# EAGLE design NES Buttons (EAGLE 7.6.0)
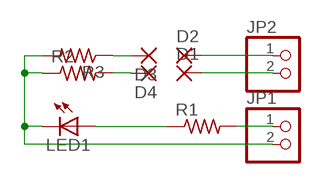
[diagram p0: schematic, sheet 1]

## Parts
D1  2,15/1,0  [2,15/1,0]
D2  2,15/1,0  [2,15/1,0]
D3  2,15/1,0  [2,15/1,0]
D4  2,15/1,0  [2,15/1,0]
JP1  PINHD-1X2  [1X02]
JP2  PINHD-1X2  [1X02]
LED1  LED3MM  [LED3MM]
R1  R-US_R1206  [R1206]
R2  R-US_R1206  [R1206]
R3  R-US_R1206  [R1206]

## Nets
GND: JP1.2 LED1.K(C) R2.1 R3.2
N$1: JP1.1 R1.2
N$2: D3.1(P) R3.1
N$3: D4.1(P) R2.2
N$4: LED1.A R1.1
N$6: D1.1(P) JP2.2
N$7: D2.1(P) JP2.1

## Library data of the parts
D1-D4 = wirepad:2,15/1,0: THROUGH-HOLE PAD
JP1 JP2 = pinhead:PINHD-1X2: PIN HEADER
LED1 = led:LED: LED OSRAM: - CHIPLED LG R971, LG N971, LY N971, LG Q971, LY Q971, LO R971, LY R971 LH N974, LH R974 LS Q976, LO Q976, LY Q976 LO Q996 - Hyper CHIPLED LW Q18S LB Q993, LB Q99A, LB R99A - SideLED LS A670, LO A670, LY A670, LG A670, LP A670 LB A673, LV A673, LT A673, LW A673 LH A674 LY A675 LS A676, LA A676, LO A676, LY A676, LW A676 LS A679, LY A679, LG A679 - Hyper Micro SIDELED® LS Y876, LA Y876, LO Y876, LY Y876 LT Y87S - SmartLED LW L88C, LW L88S LB L89C, LB L89S, LG L890 LS L89K, LO L89K, LY L89K LS L896, LA L896, LO L896, LY L896 - TOPLED LS T670, LO T670, LY T670, LG T670, LP T670 LSG T670, LSP T670, LSY T670, LOP T670, LYG T670 LG T671, LOG T671, LSG T671 LB T673, LV T673, LT T673, LW T673 LH T674 LS T676, LA T676, LO T676, LY T676, LB T676, LH T676, LSB T676, LW T676 LB T67C, LV T67C, LT T67C, LS T67K, LO T67K, LY T67K, LW E67C LS E67B, LA E67B, LO E67B, LY E67B, LB E67C, LV E67C, LT E67C LW T67C LS T679, LY T679, LG T679 LS T770, LO T770, LY T770, LG T770, LP T770 LB T773, LV T773, LT T773, LW T773 LH T774 LS E675, LA E675, LY E675, LS T675 LS T776, LA T776, LO T776, LY T776, LB T776 LHGB T686 LT T68C, LB T68C - Hyper Mini TOPLED® LB M676 - Mini TOPLED Santana® LG M470 LS M47K, LO M47K, LY M47K Source: http://www.osram.convergy.de LUXEON: - LUMILED® LXK2-PW12-R00, LXK2-PW12-S00, LXK2-PW14-U00, LXK2-PW14-V00 LXK2-PM12-R00, LXK2-PM12-S00, LXK2-PM14-U00 LXK2-PE12-Q00, LXK2-PE12-R00, LXK2-PE12-S00, LXK2-PE14-T00, LXK2-PE14-U00 LXK2-PB12-K00, LXK2-PB12-L00, LXK2-PB12-M00, LXK2-PB14-N00, LXK2-PB14-P00, LXK2-PB14-Q00 LXK2-PR12-L00, LXK2-PR12-M00, LXK2-PR14-Q00, LXK2-PR14-R00 LXK2-PD12-Q00, LXK2-PD12-R00, LXK2-PD12-S00 LXK2-PH12-R00, LXK2-PH12-S00 LXK2-PL12-P00, LXK2-PL12-Q00, LXK2-PL12-R00 Source: www.luxeon.com KINGBRIGHT: KA-3528ASYC Source: www.kingbright.com
R1-R3 = resistor:R-US_: RESISTOR, American symbol

## Board
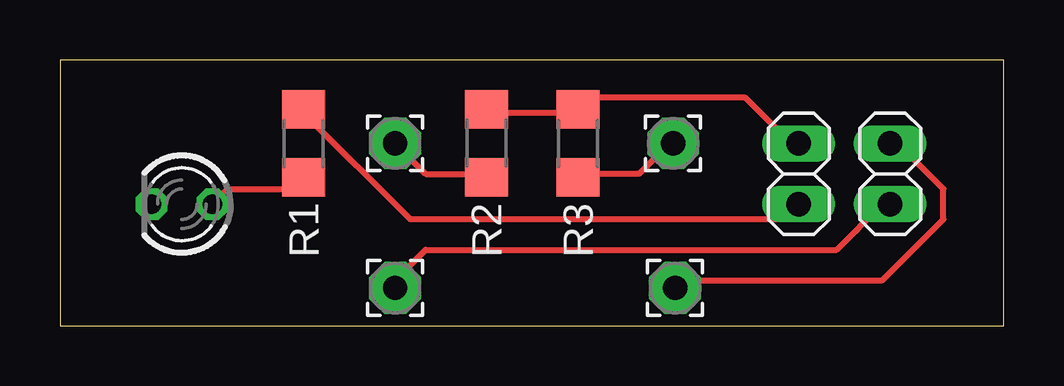
[diagram p1: board, top side]
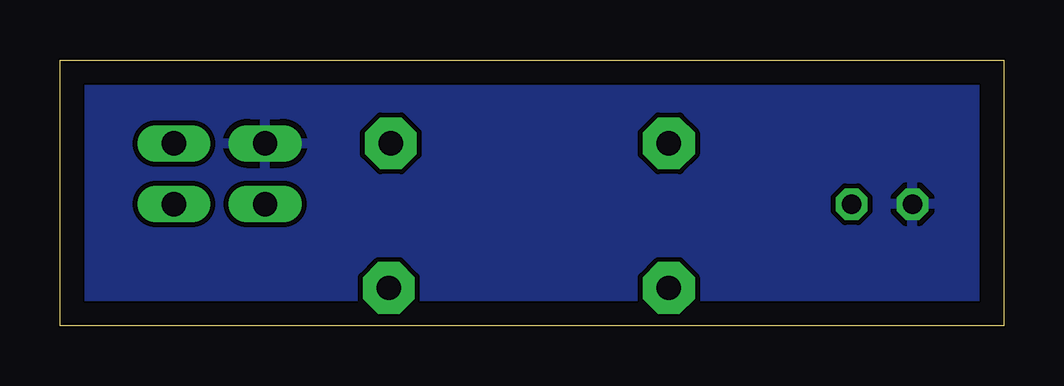
[diagram p2: board, bottom side, seen from below]

Size 39.35 x 11.1 mm. Coordinates in mm from the lower left corner, seen from the top.
Outline: 0,0 39.35,0 39.35,11.1 0,11.1 0,0
Copper layers (1*16): Top 0.035mm / dielectric 1.5mm / Bottom 0.035mm
Design rules "default": minimum track width 10mil, minimum drill 24mil, track to track 8mil, track to pad 8mil, pad to pad 8mil, via to via 8mil, smd to smd 8mil, copper to edge 40mil, drill to drill 8mil, minimum pad ring 10mil, minimum via ring 8mil, stop-mask expansion 4mil, vias tented up to drill 0mil, thermal gap 10mil

### Footprints (pad centres in the part's own frame; a part is rotated, then mirrored left to right if it is on the bottom)
2,15/1,0 = drill 1.016 pad 2.159 octagon: 1 0,0
1X02 = drill 1.016 long: 1 -1.27,0; 2 1.27,0
LED3MM = drill 0.813 octagon: A -1.27,0; K 1.27,0
R1206 = smd 1.6 x 1.803: 1 -1.422,0; 2 1.422,0

### Placement (x,y rotation side)
D1  25.64,1.59 0 top
D2  13.97,1.59 0 top
D3  25.56,7.62 0 top
D4  13.97,7.62 0 top
JP1  30.8,6.35 90 top
JP2  34.61,6.35 90 top
LED1  5.08,5.08 180 top
R1  10.16,7.62 90 top
R2  17.78,7.62 270 top
R3  21.59,7.62 90 top

### Tracks (layer width: path | path; a pad name or v marks a point on that pad's centre or on a via)
GND
  Top 0.254: R2.1 17.78,8.89 21.59,8.89 R3.2 21.59,9.53 28.57,9.53 30.48,7.62 JP1.2
  pour Bottom: 0,0 39.37,0 39.37,11.11 0,11.11
N$1
  Top 0.254: R1.2 10.16,8.89 14.61,4.45 29.84,4.45 30.48,5.08 JP1.1
N$2
  Top 0.254: R3.1 21.59,6.35 24.13,6.35 25.4,7.62 D3.1
N$3
  Top 0.254: D4.1 15.24,6.35 17.78,6.35 R2.2
N$4
  Top 0.254: LED1.A 6.99,5.71 10.16,5.71 R1.1
N$6
  Top 0.254: JP2.2 34.92,7.62 36.83,5.71 36.83,4.45 34.29,1.91 26.04,1.91 D1.1
N$7
  Top 0.254: JP2.1 34.29,5.08 32.38,3.17 15.24,3.17 13.97,1.91 D2.1

### Text on the board
tValues: GND | RST | LED | PWR | NES-BB v1.0.0